# Altium schematic sheet BH1730FVC_sensor.SchDoc: BH1730FVC sensor sheet
size A4; Date: 2015-02-21; CheckedBy: Piotr Kuligowski; Author: Michał Gumiela; DocumentNumber: 2; Revision: 1-0; SheetNumber: 2; SheetTotal: 2; Model: DM1; PageSetup: Record=PageOptions|CenterHorizontal=True|CenterVertical=True|PrintScale=0.52|XCorrection=1.00|YCorrection=1.00|PrintKind=1|BorderSize=5000000|LeftOffset=0|BottomOffset=0|Orientation=2|PaperLength=4200|PaperWidth=2970|Scale=100|PaperSource=7|PrintQuality=600|MediaType=1|DitherType=10|PaperKind=A3|PrintScaleMode=1
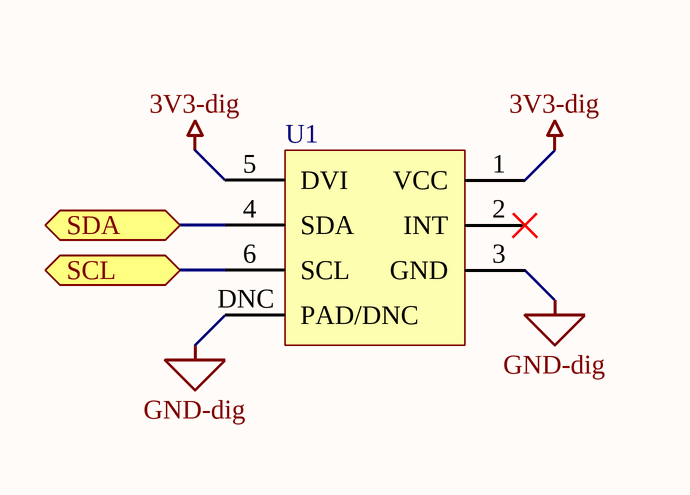
[diagram p0: BH1730FVC_sensor.SchDoc]

## Parts
U1  BH1730FVC  [WSOF6]

## Ports
SCL (bidir), SDA (bidir)

## Nets
3V3-dig: U1.1(VCC) U1.5(DVI)
GND-dig: U1.3(GND) U1.DNC(PAD/DNC)
SCL: U1.6(SCL) ; port SCL
SDA: U1.4(SDA) ; port SDA

Not connected (* = marked no-connect by the designer): U1 2(INT)*

## Notes on the sheet
- Title:
- Sheet:
- of
- Author:
- Model:
- Document Number:
- Checked by:
- Iss-Rev:
- Approved by:
- Date:
- File name:

## Library data of the parts
U1 = BH1730FVC: Digital 16bit Serial Output Type  Ambient Light Sensor IC; Manufacturer: ROHM; ManufacturerPartNumber: BH1730FVC